# Altium schematic sheet Battery.SchDoc
size A4
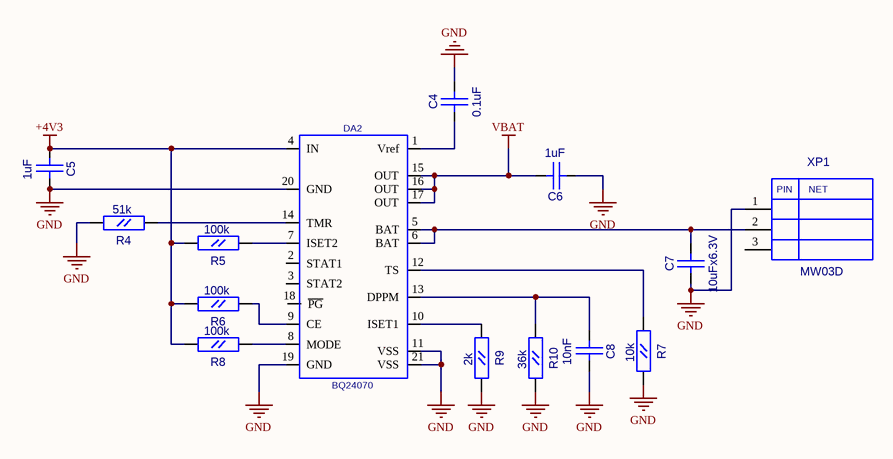
[diagram p0: Battery.SchDoc]

## Parts
C4  0.1uF  [CC0603]
C5  1uF  [CC0603]
C6  1uF  [CC0603]
C7  10uFx6.3V  [CC0805]
C8  10nF  [CC0603]
DA2  BQ24070  [P-PQFP-N20]
R4  51k  [RC0603]
R5  100k  [RC0603]
R6  100k  [RC0603]
R7  10k  [RC0603]
R8  100k  [RC0603]
R9  2k  [RC0603]
R10  36k  [RC0603]
XP1  MW03D  [MW03D]

## Nets
+4V3: C5.1(A) DA2.4(IN) R5.2(B) R6.2(B) R8.2(B)
GND: C4.2(B) C5.2(B) C6.1(A) C7.1(A) C8.2(B) DA2.11(VSS) DA2.19(GND) DA2.20(GND) DA2.21(VSS) R4.2(B) R7.2(B) R9.2(B) R10.2(B) XP1.1
VBAT: C6.2(B) DA2.15(OUT) DA2.16(OUT) DA2.17(OUT)
NetC4_1: C4.1(A) DA2.1(Vref)
NetC7_2: C7.2(B) DA2.5(BAT) DA2.6(BAT) XP1.2
NetC8_1: C8.1(A) DA2.13(DPPM) R10.1(A)
NetDA2_7: DA2.7(ISET2) R5.1(A)
NetDA2_8: DA2.8(MODE) R8.1(A)
NetDA2_9: DA2.9(CE) R6.1(A)
NetDA2_10: DA2.10(ISET1) R9.1(A)
NetDA2_12: DA2.12(TS) R7.1(A)
NetDA2_14: DA2.14(TMR) R4.1(A)

Not connected (* = marked no-connect by the designer): DA2 2(STAT1) 3(STAT2) 18(~{PG}); XP1 3

## Notes on the sheet
- (in symbol MW03D) PIN; NET

## Library data of the parts
C4-C6 C8 = CC0603
  C4: Value: 0.1uF
  C5 C6: Value: 1uF
  C8: Value: 10nF
C7 = CC0805: Value: 10uFx6.3V
R4-R10 = RC0603
  R4: Value: 51k
  R5 R6 R8: Value: 100k
  R7: Value: 10k
  R9: Value: 2k
  R10: Value: 36k
DA2 = BQ24070: Value: *
XP1 = MW03D: Value: *